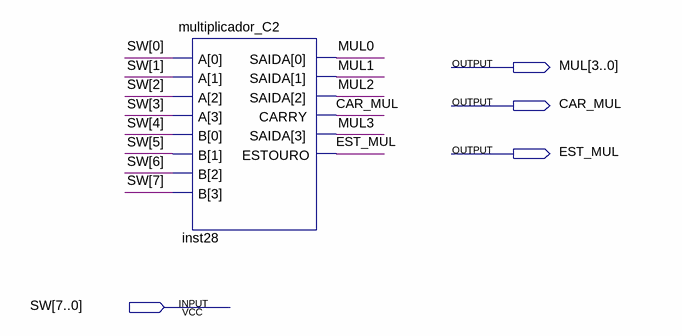
[diagram p0: schematic sheet]
// Quartus schematic teste.bdf as structural Verilog: 1 symbols, 4 pins
module teste (
  input  [7:0] SW,
  output [3:0] MUL,
  output CAR_MUL,
  output EST_MUL
);

  multiplicador_C2 inst28 (.A(SW[3:0]), .B(SW[7:4]), .SAIDA(MUL), .CARRY(CAR_MUL), .ESTOURO(EST_MUL));
endmodule
